# EAGLE design tempLogger (EAGLE 8.0.1)
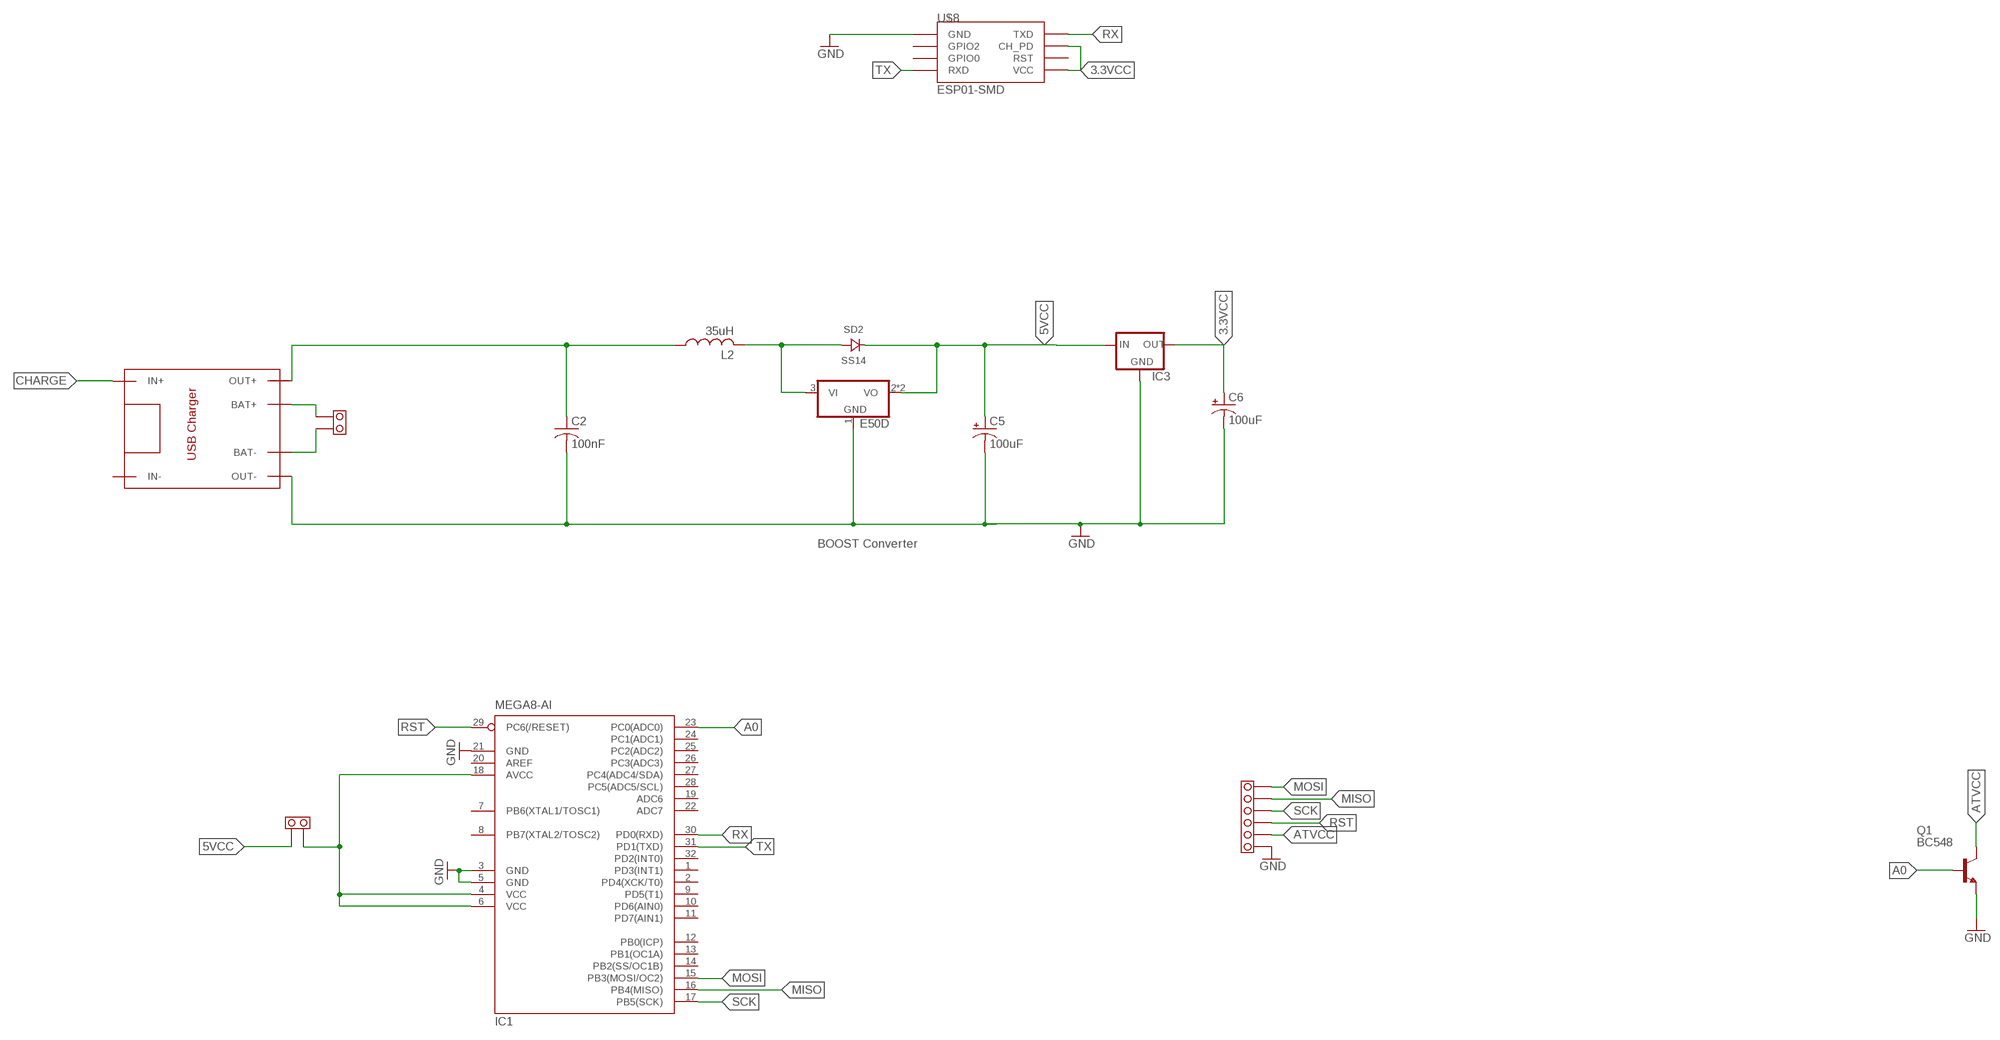
[diagram p0: schematic, sheet 1]

## Parts
C2  100nF  C-USC1206  [C1206]
C5  100uF  CPOL-US150CLZ-0810  [150CLZ-0810]
C6  100uF  CPOL-US153CLV-0405  [153CLV-0405]
IC1  MEGA8-AI  [TQFP32-08]
IC2  E50D  [SOT89]
IC3  LM1117  [SOT223]
L2  35uH  L-USPIS2816  [PIS2816]
Q1  BC548  [TO92-EBC]
SD2  SS14  [DO214]
U$1  BERG_2  [BERG_2]
U$2  TP4056  [TP4056]
U$3  BERG_6  [BERG_6]
U$4  BERG_2  [BERG_2]
U$8  ESP01-SMD  [ESP01_SMD]

## Nets
3.3VCC: C6.+ IC3.2(OUT) U$8.CH_PD U$8.VCC
5VCC: C5.+ IC2.2(VO) IC2.2@1(VO) IC3.3(IN) SD2.CATHODE U$1.F
A0: IC1.23(PC0(ADC0)) Q1.B
ATVCC: IC1.4(VCC) IC1.6(VCC) IC1.18(AVCC) Q1.C U$1.E U$3.I
CHARGE: U$2.IN+
GND: C2.2 C5.- C6.- IC1.3(GND) IC1.5(GND) IC1.21(GND) IC2.1(GND) IC3.1(GND) Q1.E U$2.OUT- U$3.J U$8.GND
MISO: IC1.16(PB4(MISO)) U$3.F
MOSI: IC1.15(PB3(MOSI/OC2)) U$3.E
N$1: IC2.3(VI) L2.2 SD2.ANODE
N$3: U$2.BAT+ U$4.F
N$4: U$2.BAT- U$4.E
N$6: C2.1 L2.1 U$2.OUT+
RST: IC1.29(PC6(/RESET)) U$3.H
RX: IC1.30(PD0(RXD)) U$8.TX(TXD)
SCK: IC1.17(PB5(SCK)) U$3.G
TX: IC1.31(PD1(TXD)) U$8.RX(RXD)
Unconnected: IC1.1(PD3(INT1)) IC1.2(PD4(XCK/T0)) IC1.7(PB6(XTAL1/TOSC1)) IC1.8(PB7(XTAL2/TOSC2)) IC1.9(PD5(T1)) IC1.10(PD6(AIN0)) IC1.11(PD7(AIN1)) IC1.12(PB0(ICP)) IC1.13(PB1(OC1A)) IC1.14(PB2(SS/OC1B)) IC1.19(ADC6) IC1.20(AREF) IC1.22(ADC7) IC1.24(PC1(ADC1)) IC1.25(PC2(ADC2)) IC1.26(PC3(ADC3)) IC1.27(PC4(ADC4/SDA)) IC1.28(PC5(ADC5/SCL)) IC1.32(PD2(INT0)) U$2.IN- U$8.GPIO0 U$8.GPIO2 U$8.RST

## Notes on the sheet
- BOOST Converter

## Library data of the parts
C2 = rcl:C-US: CAPACITOR, American symbol
C5 C6 = rcl:CPOL-US: POLARIZED CAPACITOR, American symbol
IC1 = atmel:MEGA8: MICROCONTROLLER 8 Kbytes FLASH, 1 kbytes SRAM, 512 bytes EEPROM, USART, 6-channel 10 bit ADC, 2-channel 8 bit ADC Pin compatible with Atmega48, ATMega88, ATMega168 Source: avr.lbr; MPN: ATMEGA8-16AU; OC_FARNELL: 9171371; OC_NEWARK: 73M8863
IC2 = dragCustom:E50D
IC3 = v-reg-3:LM1117
L2 = rcl:L-US: INDUCTOR, American symbol
Q1 = transistor-npn:BC548*: NPN Transistor
SD2 = ihpcb-diode:SS14
U$1 U$4 = dragCustom:BERG_2
U$2 = TP4056 charging module:TP4056
U$3 = dragCustom:BERG_6
U$8 = ESP8266Modules:ESP01-SMD

## Board
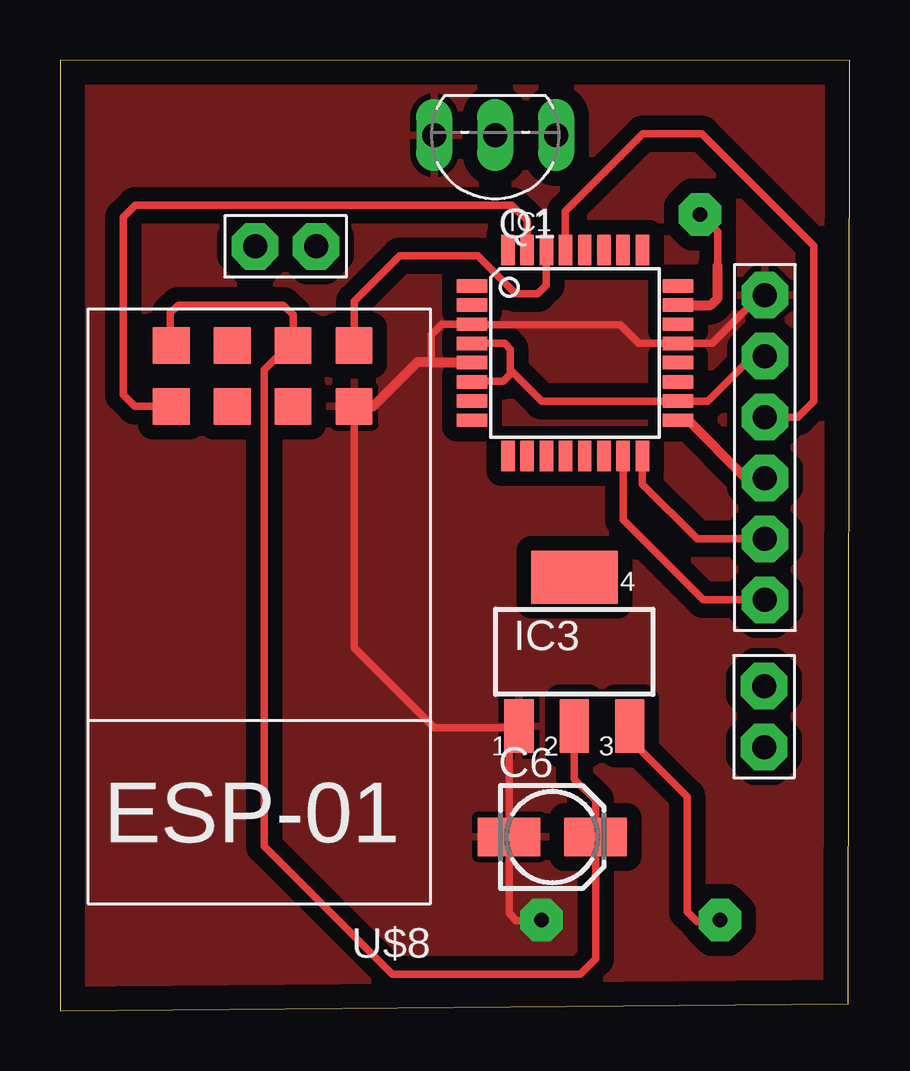
[diagram p1: board, top side]
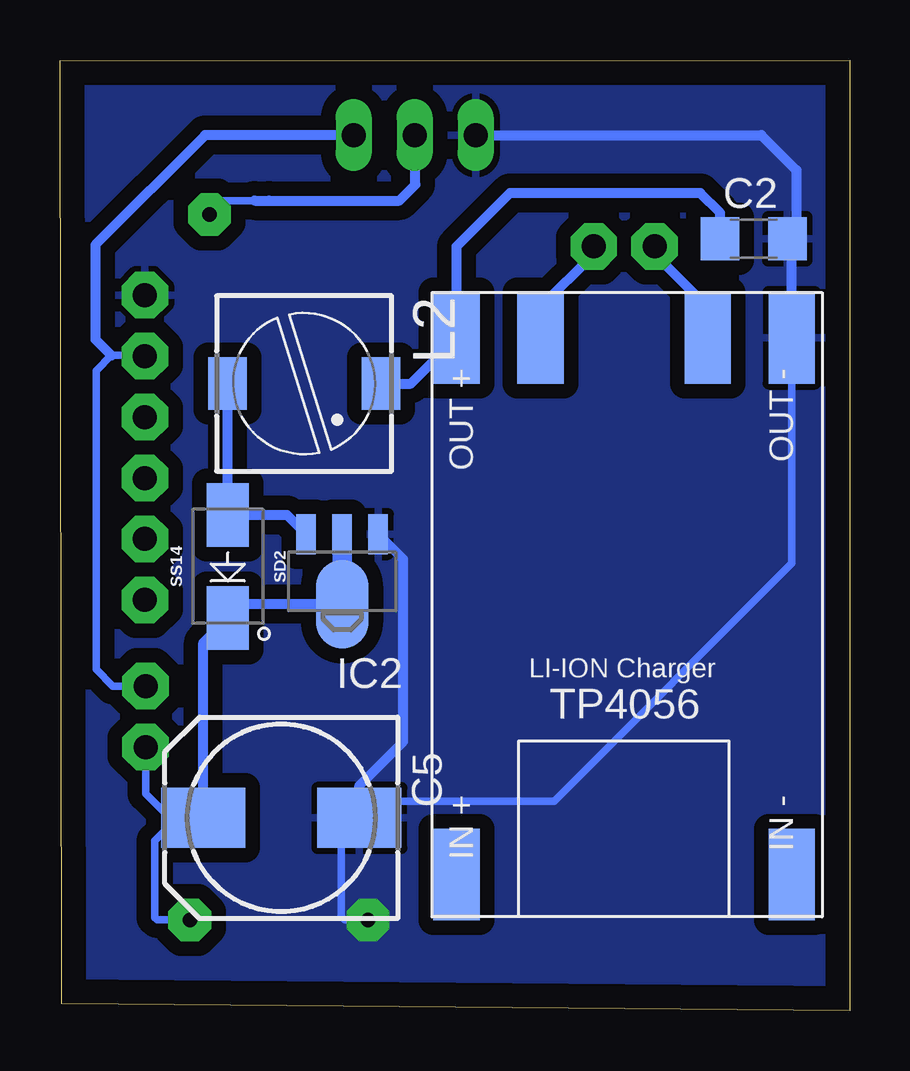
[diagram p2: board, bottom side, seen from below]

Size 32.9 x 39.61 mm. Coordinates in mm from the lower left corner, seen from the top.
Outline: 0,0 32.84,0.29 32.9,39.58 0,39.61 0,0
Copper layers (1*16): Top 0.035mm / dielectric 1.5mm / Bottom 0.035mm
Design rules "default": minimum track width 10mil, minimum drill 24mil, track to track 8mil, track to pad 8mil, pad to pad 8mil, via to via 8mil, smd to smd 8mil, copper to edge 40mil, drill to drill 8mil, minimum pad ring 10mil, minimum via ring 8mil, stop-mask expansion 4mil, vias tented up to drill 0mil, thermal gap 10mil

### Footprints (pad centres in the part's own frame; a part is rotated, then mirrored left to right if it is on the bottom)
C1206 = smd 1.6 x 1.8: 1 -1.4,0; 2 1.4,0
150CLZ-0810 = smd 3.5 x 2.5: + 3.25,0; - -3.25,0
153CLV-0405 = smd 2.6 x 1.6: + 1.8,0; - -1.8,0
TQFP32-08 = smd 1.27 x 0.559: 1 -4.293,2.8; 2 -4.293,2; 3 -4.293,1.2; 4 -4.293,0.4; 5 -4.293,-0.4; 6 -4.293,-1.2; 7 -4.293,-2; 8 -4.293,-2.8; 17 4.293,-2.8; 18 4.293,-2; 19 4.293,-1.2; 20 4.293,-0.4; 21 4.293,0.4; 22 4.293,1.2; 23 4.293,2; 24 4.293,2.8 | smd 0.559 x 1.27: 9 -2.8,-4.293; 10 -2,-4.293; 11 -1.2,-4.293; 12 -0.4,-4.293; 13 0.4,-4.293; 14 1.2,-4.293; 15 2,-4.293; 16 2.8,-4.293; 25 2.8,4.293; 26 2,4.293; 27 1.2,4.293; 28 0.4,4.293; 29 -0.4,4.293; 30 -1.2,4.293; 31 -2,4.293; 32 -2.8,4.293
SOT89 = smd 0.813 x 1.676: 1 -1.499,-1.981; 2 0,-1.981; 3 1.499,-1.981 | smd 2.2 x 3.7: 2@1 0,0.94
SOT223 = smd 1.219 x 2.235: 1 -2.311,-3.099; 2 0,-3.099; 3 2.311,-3.099 | smd 3.6 x 2.2: 4 0,3.099
PIS2816 = smd 2.2 x 1.6: 1 0,3.2; 2 0,-3.2
TO92-EBC = drill 1 long: B 0,-1.27; C -2.54,-1.27; E 2.54,-1.27
DO214 = smd 2.65 x 1.75: ANODE -2.15,0; CATHODE 2.15,0
BERG_2 = drill 1 pad 1.93 octagon: E 0,2.54; F 0,0
TP4056 = smd 1.93 x 3.81: BAT+ 5.39,-10.16; BAT- -1.58,-10.16; IN+ 8.89,12.2; IN- -5.08,12.2; OUT+ 8.89,-10.16; OUT- -5.08,-10.16
BERG_6 = drill 1 pad 1.93 octagon: E 0,7.62; F 0,5.08; G 0,2.54; H 0,0; I 0,-2.54; J 0,-5.08
ESP01_SMD = smd 1.524 x 1.524: CH_PD -1.27,-8.255; GND -3.81,-5.715; GPIO0 1.27,-5.715; GPIO2 -1.27,-5.715; RST 1.27,-8.255; RX 3.81,-5.715; TX -3.81,-8.255; VCC 3.81,-8.255

### Placement (x,y rotation side)
C2  4,32.16 0 bottom
C5  23.69,8.03 180 bottom
C6  20.51,7.24 0 top
IC1  21.46,27.4 0 top
IC2  21.15,17.88 180 bottom
IC3  21.43,14.95 0 top
L2  22.73,26.13 270 bottom
Q1  18.13,35.21 180 top
SD2  25.91,18.51 270 bottom
U$1  29.34,10.99 0 top
U$2  7.49,17.88 180 bottom
U$3  29.37,24.73 180 top
U$4  10.67,31.85 90 top
U$8  8.45,19.46 180 top

### Tracks (layer width: path | path; a pad name or v marks a point on that pad's centre or on a via)
3.3VCC
  Top 0.305: IC3.2 21.43,9.65 22.32,8.76 C6.+ 22.32,7.23 22.32,3.33 | U$8.VCC 4.6,27.75 4.6,29.08 4.92,29.4 9.3,29.4 9.71,28.99 U$8.CH_PD 9.52,27.72 8.51,26.7 8.51,6.86 13.84,1.52 21.69,1.52 22.32,2.16 22.32,3.33 | 22.32,3.08 22.32,3.33
5VCC  (via drill 0.6 pad 1.78)
  Top 0.305: IC3.3 23.74,11.31 26.13,8.92 26.13,4.13 26.54,3.71 27.08,3.71 27.11,3.75 27.46,3.75 v27.5,3.78
  Bottom 0.305: U$1.F 29.34,9.05 28.16,7.87 | 28.16,7.87 27.09,7.87 C5.+ | v27.5,3.78 28.86,3.78 28.96,3.87 28.96,7.08 28.16,7.87
  Bottom 0.406: IC2.2 IC2.2@1 25.33,16.93 SD2.CATHODE 26.94,15.33 C5.+
A0  (via drill 0.6 pad 1.78)
  Top 0.305: 27.4,31.02 27.4,32.45 v26.67,33.18
  Top 0.406: IC1.23 27.11,29.4 27.4,29.69 27.4,31.02
  Bottom 0.305: 24.19,33.75 26.1,33.75 v26.67,33.18
  Bottom 0.406: v26.67,33.18 26.67,33.31 | 24.8,33.75 24.19,33.75 18.76,33.75 18.1,34.42 18.1,36.45 Q1.B
ATVCC
  Top 0.305: U$3.I 28.86,27.27 26.99,25.4 IC1.18 | IC1.18 | IC1.4 18.52,27.8 18.76,27.56 18.76,26.7 | 18.76,26.7 18.76,26.51 18.48,26.23 17.2,26.23 IC1.6 | IC1.18 20.07,25.4 18.76,26.7
  Bottom 0.305: U$1.E 30.7,13.53 31.4,14.22 31.4,26.67 30.77,27.3 29.4,27.3 U$3.I
  Bottom 0.406: Q1.C 26.86,36.48 31.43,31.91 31.43,27.97 30.77,27.3
GND  (via drill 0.6 pad 1.78)
  Top 0.305: U$3.J 29.18,29.81 27.18,27.81 25.77,27.81 IC1.21 24.11,27.8 23.34,28.57 17.2,28.57 IC1.3 15.9,28.6 15.46,28.16 15.46,27.08 15.53,27.02 | U$8.GND 12.26,15.11 15.59,11.78 19.04,11.78 IC3.1 18.71,11.45 C6.- 18.71,4.05 19.02,3.75 20.03,3.75 v20.07,3.78
  Top 0.406: U$8.GND 13.05,25.18 14.89,27.02 15.53,27.02 17.15,27.02 IC1.5
  Bottom 0.305: v20.07,3.78 21.05,3.78 21.18,3.91 21.18,7.29 C5.- 19.74,8.73 12.32,8.73 2.41,18.64 U$2.OUT-
  Bottom 0.406: C5.- 20.44,9.38 18.61,11.21 18.61,18.82 IC2.1 | 2.1,28.67 2.1,28.35 U$2.OUT- 2.41,31.98 C2.2 2.22,32.54 2.22,35.02 3.68,36.48 Q1.E
  pour Top (isolate 0.61): -0.13,39.78 32.89,39.78 32.89,0.41 -0.13,0.41
  pour Bottom (isolate 0.61): -0.13,39.78 32.89,39.78 32.89,0.41 -0.13,0.41
MISO
  Top 0.305: U$3.F 26.54,19.65 24.26,21.94 IC1.16
MOSI
  Top 0.305: IC1.15 23.46,20.45 26.8,17.11 U$3.E
N$1
  Bottom 0.406: IC2.3 23.45,20.66 SD2.ANODE 25.93,20.69 L2.2
N$3
  Bottom 0.406: U$4.F 10.67,31.53 12.89,29.3 U$2.BAT+
N$4
  Bottom 0.406: U$4.E 8.13,31.53 6.22,29.62 6.22,28.34 U$2.BAT-
N$6
  Bottom 0.406: C2.1 5.4,33.25 6.22,34.07 14.16,34.07 16.38,31.84 U$2.OUT+ 18.29,26.13 L2.1
RST
  Top 0.305: U$3.H 30.73,24.73 31.4,25.4 31.4,31.88 26.73,36.54 24.29,36.54 21.05,33.31 21.05,31.71 IC1.29
RX
  Top 0.305: IC1.30 20.26,30.23 19.91,29.88 18.99,29.88 17.4,31.46 14.16,31.46 12.26,29.56 U$8.TX
SCK
  Top 0.406: IC1.17 26.17,24.6 28.58,22.19 U$3.G
TX
  Top 0.305: U$8.RX 3.11,25.18 2.63,25.65 2.63,33.05 3.14,33.56 18.83,33.56 19.46,32.92 IC1.31 | IC1.31